# EAGLE schematic High-Level PCB v3.0 (EAGLE 8.7.0)
TITLE: High-Level PCB
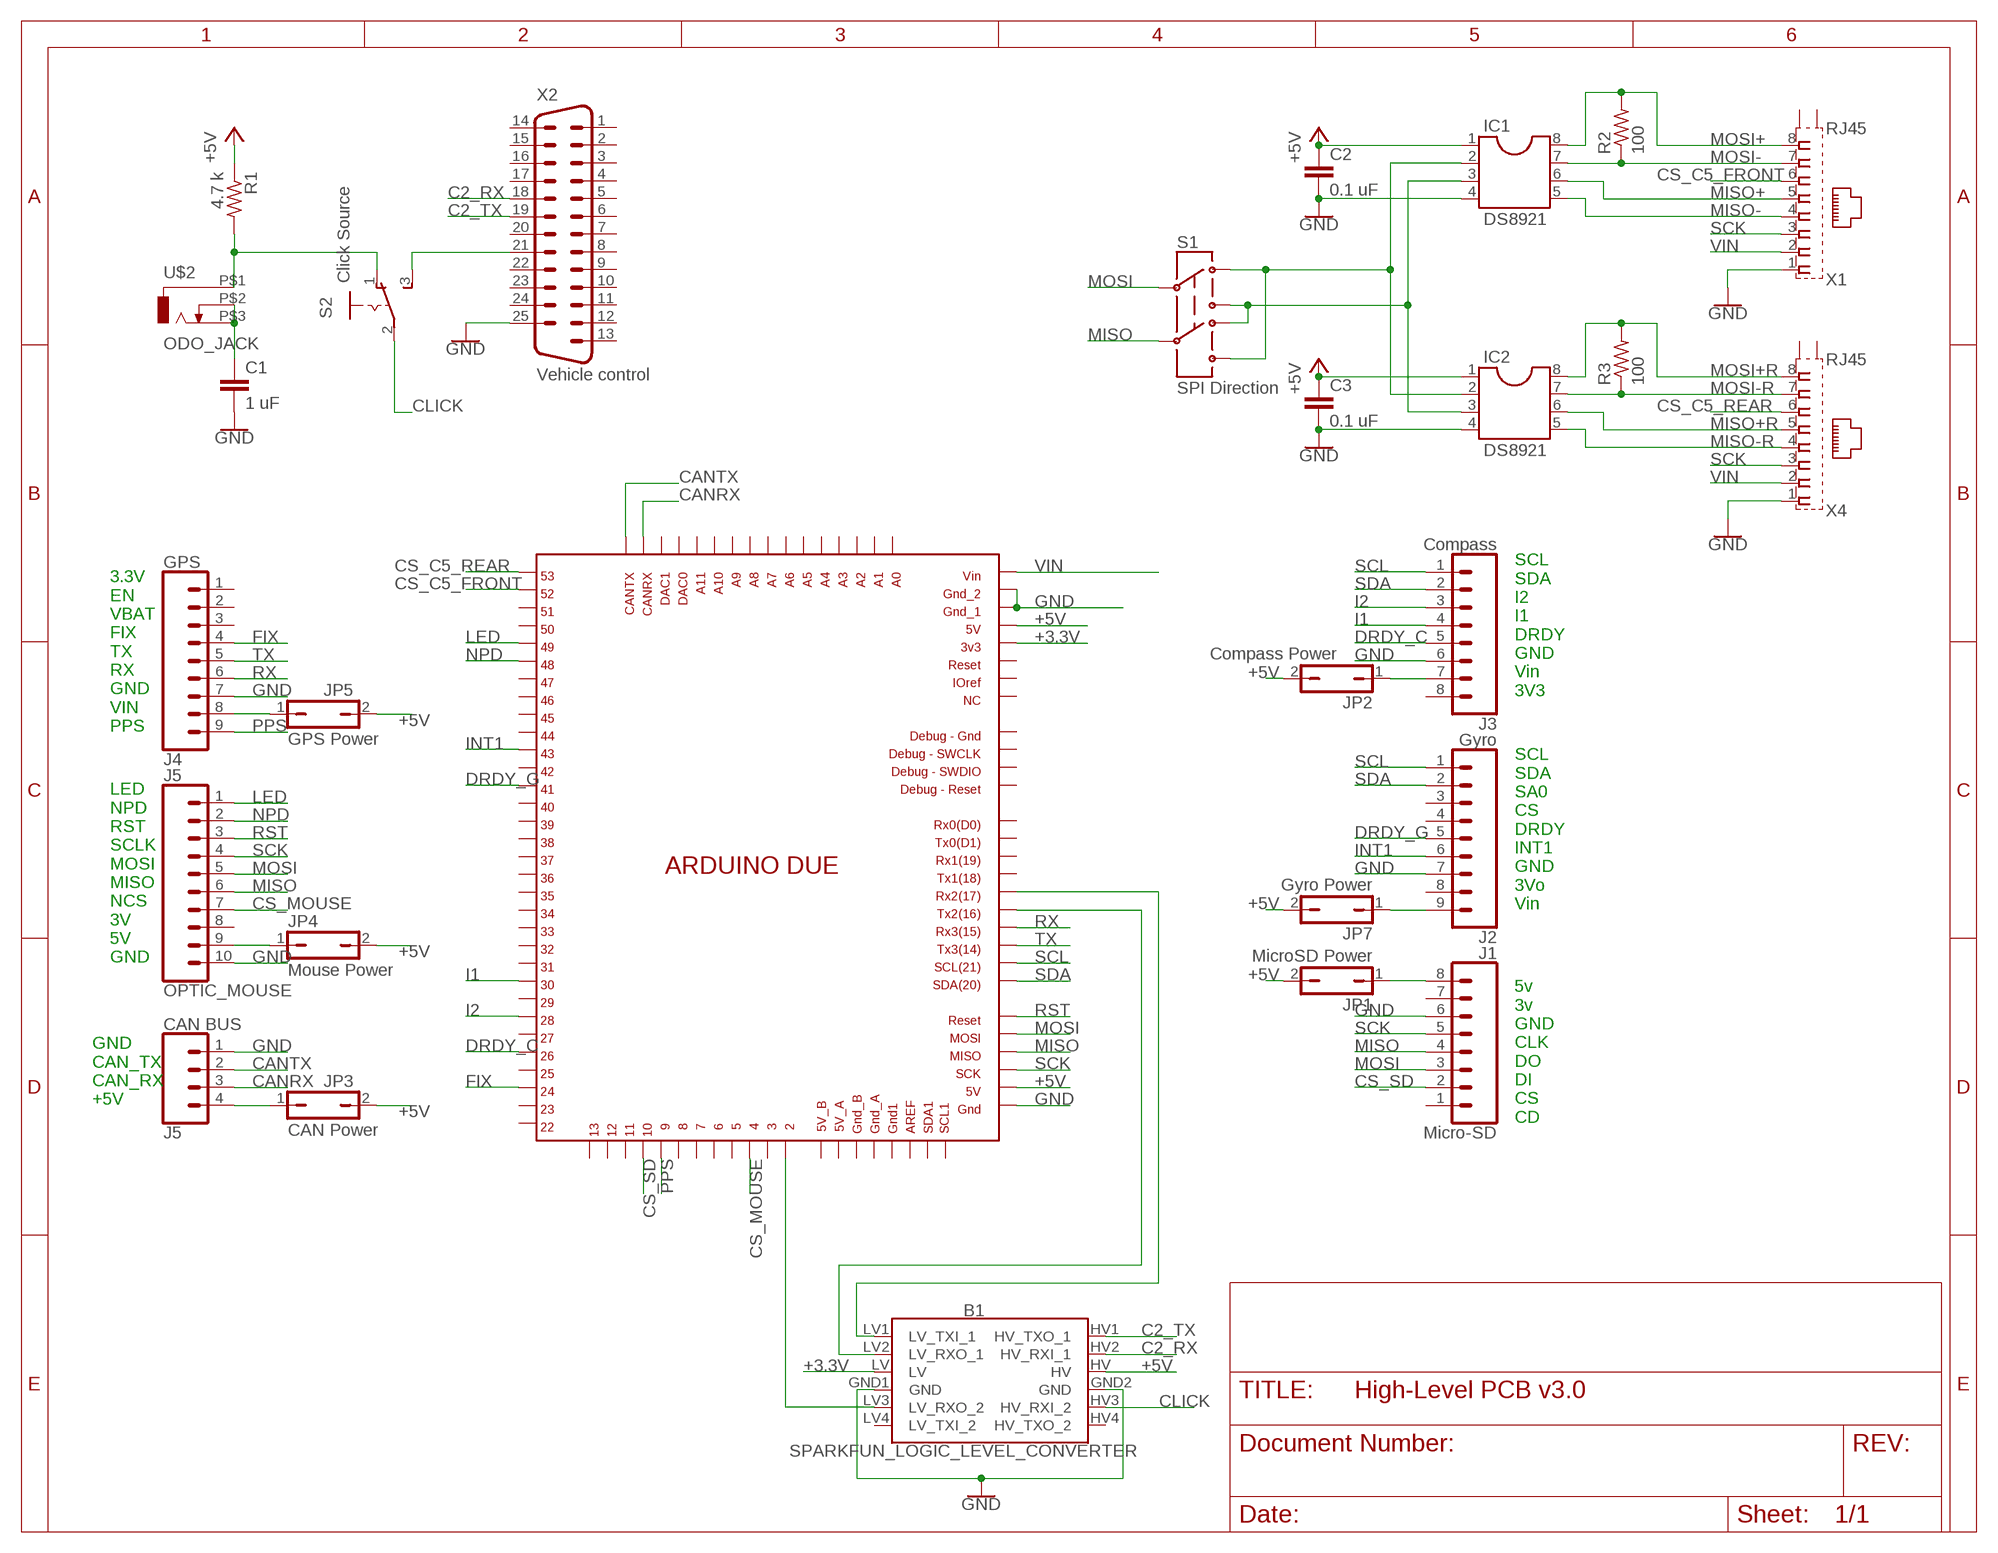
[diagram p0: schematic, sheet 1]

## Parts
B1  SPARKFUN_LOGIC_LEVEL_CONVERTER  [SPARKFUN_LOGIC_LEVEL_CONVERTER]
C1  1 uF  C2.5/5  [C2.5-5]
C2  0.1 uF  C2.5/5  [C2.5-5]
C3  0.1 uF  C2.5/5  [C2.5-5]
IC1  DS8921  DIL8  [DIL08]
IC2  DS8921  DIL8  [DIL08]
J1  Micro-SD  CONN_08"  [1X08]
J2  Gyro  CONN_09  [1X09]
J3  Compass  CONN_08"  [1X08]
J4  GPS  CONN_09  [1X09]
J5  CAN BUS  CONN_04  [1X04]
JP1  MicroSD Power  JP1Q  [JP1]
JP2  Compass Power  JP1Q  [JP1]
JP3  CAN Power  JP1Q  [JP1]
JP4  Mouse Power  JP1Q  [JP1]
JP5  GPS Power  JP1Q  [JP1]
JP7  Gyro Power  JP1Q  [JP1]
OPTIC_MOUSE  J5  CONN_10"  [1X10]
R1  4.7 k  R-US_0204/5  [0204/5]
R2  100  R-US_0204/5  [0204/5]
R3  100  R-US_0204/5  [0204/5]
S1  SPI Direction  DPDT_DEV6X5MM_PAC  [NEWSWITCH2_PAC]
S2  Click Source  255SB  [255SB]
U$1  DUE(NORMAL)  [DUE(NORMAL)]
U$2  ODO_JACK  [ODO_JACK]
X1  RJ45  GLX-S-88M  [GLX-S-88M]
X2  Vehicle control  M25H  [M25H]
X4  RJ45  GLX-S-88M  [GLX-S-88M]

## Nets
+3.3V: B1.LV U$1.3V3
+5V: B1.HV C2.1 C3.1 IC1.1 IC2.1 JP1.2 JP2.2 JP3.2 JP4.2 JP5.2 JP7.2 R1.1 U$1.5V U$1.GND_ICSP
C2_RX: B1.HV2(HV_RXI_1) X2.18
C2_TX: B1.HV1(HV_TXO_1) X2.19
CANRX: J5.3 U$1.CANRX
CANTX: J5.2 U$1.CANTX
CLICK: B1.HV3(HV_RXI_2) S2.2(P)
CS_C5_FRONT: U$1.52 X1.6
CS_C5_REAR: U$1.53 X4.6
CS_MOUSE: OPTIC_MOUSE.7 U$1.4
CS_SD: J1.2 U$1.10
DRDY_C: J3.5 U$1.26
DRDY_G: J2.5 U$1.41
FIX: J4.4 U$1.24
GND: B1.GND1(GND) B1.GND2(GND) C1.2 C2.2 C3.2 IC1.4 IC2.4 J1.6 J2.7 J3.6 J4.7 J5.1 OPTIC_MOUSE.10 U$1.5V_ICSP U$1.GND_1 U$1.GND_2 X1.1 X2.25 X4.1
I1: J3.4 U$1.30
I2: J3.3 U$1.28
INT1: J2.6 U$1.43
LED: OPTIC_MOUSE.1 U$1.49
MISO: J1.4 OPTIC_MOUSE.6 S1.PIN5 U$1.MISO_ICSP
MISO+: IC1.6 X1.5
MISO+R: IC2.6 X4.5
MISO-: IC1.5 X1.4
MISO-R: IC2.5 X4.4
MOSI: J1.3 OPTIC_MOUSE.5 S1.PIN2 U$1.MOSI_ICSP
MOSI+: IC1.8 R2.2 X1.8
MOSI+R: IC2.8 R3.2 X4.8
MOSI-: IC1.7 R2.1 X1.7
MOSI-R: IC2.7 R3.1 X4.7
N$1: C1.1 U$2.P$2 U$2.P$3
N$2: IC1.2 IC2.2 S1.PIN1 S1.PIN6
N$3: IC1.3 IC2.3 S1.PIN3 S1.PIN4
N$4: B1.LV1(LV_TXI_1) U$1.RX2
N$5: B1.LV2(LV_RXO_1) U$1.TX2
N$6: S2.3(S) X2.21
N$7: R1.2 S2.1(O) U$2.P$1
N$8: J3.7 JP2.1
N$9: J2.9 JP7.1
N$10: J1.8 JP1.1
N$11: J5.4 JP3.1
N$12: B1.LV3(LV_RXO_2) U$1.2
N$13: JP4.1 OPTIC_MOUSE.9
N$14: J4.8 JP5.1
NPD: OPTIC_MOUSE.2 U$1.48
PPS: J4.9 U$1.9
RST: OPTIC_MOUSE.3 U$1.RESET_ICSP
RX: J4.6 U$1.RX3
SCK: J1.5 OPTIC_MOUSE.4 U$1.SCK_ICSP X1.3 X4.3
SCL: J2.1 J3.1 U$1.SCL
SDA: J2.2 J3.2 U$1.SDA
TX: J4.5 U$1.TX3
VIN: U$1.VIN X1.2 X4.2
Unconnected: B1.HV4(HV_TXO_2) B1.LV4(LV_TXI_2) J1.1 J1.7 J2.3 J2.4 J2.8 J3.8 J4.1 J4.2 J4.3 OPTIC_MOUSE.8 U$1.3 U$1.5 U$1.5V_A U$1.5V_B U$1.6 U$1.7 U$1.8 U$1.11 U$1.12 U$1.13 U$1.22 U$1.23 U$1.25 U$1.27 U$1.29 U$1.31 U$1.32 U$1.33 U$1.34 U$1.35 U$1.36 U$1.37 U$1.38 U$1.39 U$1.40 U$1.42 U$1.44 U$1.45 U$1.46 U$1.47 U$1.50 U$1.51 U$1.A0 U$1.A1 U$1.A2 U$1.A3 U$1.A4 U$1.A5 U$1.A6 U$1.A7 U$1.A8 U$1.A9 U$1.A10 U$1.A11 U$1.AREF U$1.DAC0 U$1.DAC1 U$1.GND1 U$1.GND_A U$1.GND_B U$1.GND_DEBUG U$1.IOREF U$1.NC U$1.RESET U$1.RESET_DEBUG U$1.RX0 U$1.RX1 U$1.SCL1 U$1.SDA1 U$1.SWCLK_DEBUG U$1.SWDIO_DEBUG U$1.TX0 U$1.TX1 X1.S1 X1.S2 X2.1 X2.2 X2.3 X2.4 X2.5 X2.6 X2.7 X2.8 X2.9 X2.10 X2.11 X2.12 X2.13 X2.14 X2.15 X2.16 X2.17 X2.20 X2.22 X2.23 X2.24 X4.S1 X4.S2

## Notes on the sheet
- SCL
  SDA
  I2
  I1
  DRDY
  GND
  Vin
  3V3
- 3.3V
  EN
  VBAT
  FIX
  TX
  RX
  GND
  VIN
  PPS
- SCL
  SDA
  SA0
  CS
  DRDY
  INT1
  GND
  3Vo
  Vin
- LED
  NPD
  RST
  SCLK
  MOSI
  MISO
  NCS
  3V
  5V
  GND
- GND
  CAN_TX
  CAN_RX
  +5V
- 5v
  3v
  GND
  CLK
  DO
  DI
  CS
  CD

## Library data of the parts
B1 = SparkFun-Boards:SPARKFUN_LOGIC_LEVEL_CONVERTER: SparkFun Logic Level Converter -Bi-Directional This is the mechnical outline for the 3.3V - 5V bi directional logic level converter. *Note, the "LOCK" Package has the header pins staggered by an offset of 5 mils (off center line), so that when you slide a row of standard 0.1" headers into the PTH pads, it will hold position vertically. See the follwing turorial for more information on this type of special footprints: Sneaky Footprints <https://www.sparkfun.com/tutorials/114> SparkFun Products: SparkFun Logic Level Converter - Bi-Directional <https://www.sparkfun.com/products/12009>
C1-C3 = capacitor-wima:C: CAPACITOR naming: grid - package width
IC1 IC2 = ic-package:DIL8: Dual In Line / Socket
J1 J3 = SparkFun-Connectors:CONN_08: Multi connection point. Often used as Generic Header-pin footprint for 0.1 inch spaced/style header connections On any of the 0.1 inch spaced packages, you can populate with these: Break Away Headers - Straight <https://www.sparkfun.com/products/116> (PRT-00116) Break Away Male Headers - Right Angle <https://www.sparkfun.com/products/553> (PRT-00553) Female Headers <https://www.sparkfun.com/products/115> (PRT-00115) Break Away Headers - Machine Pin <https://www.sparkfun.com/products/117> (PRT-00117) Break Away Female Headers - Swiss Machine Pin <https://www.sparkfun.com/products/743> (PRT-00743) Arduino Stackable Header - 8 Pin <https://www.sparkfun.com/products/9279> (PRT-09279) For SCREWTERMINALS and SPRING TERMINALS visit here: Screw Terimnals on SparkFun.com <https://www.sparkfun.com/search/results?term=Screw+Terminals> (5mm/3.5mm/2.54mm spacing) This device is also useful as a general connection point to wire up your design to another part of your project. Our various solder wires solder well into these plated through hole pads. Hook-Up Wire - Assortment (Stranded, 22 AWG) <https://www.sparkfun.com/products/11375> (PRT-11375) Hook-Up Wire - Assortment (Solid Core, 22 AWG) <https://www.sparkfun.com/products/11367> (PRT-11367) View the entire wire category on our website here <https://www.sparkfun.com/categories/141> Special notes: Molex polarized connector foot print use with SKU : PRT-08231 with associated crimp pins and housings. 1MM SMD Version SKU: PRT-10208 NOTES ON THE VARIANTS LOCK and LOCK_LONGPADS... This footprint was designed to help hold the alignment of a through-hole component (i.e. 6-pin header) while soldering it into place. You may notice that each hole has been shifted either up or down by 0.005 of an inch from it's more standard position (which is a perfectly straight line). This slight alteration caused the pins (the squares in the middle) to touch the edges of the holes. Because they are alternating, it causes a "brace" to hold the component in place. 0.005 has proven to be the perfect amount of "off-center" position when using our standard breakaway headers. Although looks a little odd when you look at the bare footprint, once you have a header in there, the alteration is very hard to notice. Also,if you push a header all the way into place, it is covered up entirely on the bottom side.; PROD_ID: CONN-08438
J2 J4 = SparkFun-Connectors:CONN_09: Multi connection point. Often used as Generic Header-pin footprint for 0.1 inch spaced/style header connections On any of the 0.1 inch spaced packages, you can populate with these: Break Away Headers - Straight <https://www.sparkfun.com/products/116> (PRT-00116) Break Away Male Headers - Right Angle <https://www.sparkfun.com/products/553> (PRT-00553) Female Headers <https://www.sparkfun.com/products/115> (PRT-00115) Break Away Headers - Machine Pin <https://www.sparkfun.com/products/117> (PRT-00117) Break Away Female Headers - Swiss Machine Pin <https://www.sparkfun.com/products/743> (PRT-00743) For SCREWTERMINALS and SPRING TERMINALS visit here: Screw Terimnals on SparkFun.com <https://www.sparkfun.com/search/results?term=Screw+Terminals> (5mm/3.5mm/2.54mm spacing) This device is also useful as a general connection point to wire up your design to another part of your project. Our various solder wires solder well into these plated through hole pads. Hook-Up Wire - Assortment (Stranded, 22 AWG) <https://www.sparkfun.com/products/11375> (PRT-11375) Hook-Up Wire - Assortment (Solid Core, 22 AWG) <https://www.sparkfun.com/products/11367> (PRT-11367) View the entire wire category on our website here <https://www.sparkfun.com/categories/141> Special notes: Molex polarized connector foot print use with SKU : PRT-08231 with associated crimp pins and housings. 1MM SMD Version SKU: PRT-10208 NOTES ON THE VARIANTS LOCK and LOCK_LONGPADS... This footprint was designed to help hold the alignment of a through-hole component (i.e. 6-pin header) while soldering it into place. You may notice that each hole has been shifted either up or down by 0.005 of an inch from it's more standard position (which is a perfectly straight line). This slight alteration caused the pins (the squares in the middle) to touch the edges of the holes. Because they are alternating, it causes a "brace" to hold the component in place. 0.005 has proven to be the perfect amount of "off-center" position when using our standard breakaway headers. Although looks a little odd when you look at the bare footprint, once you have a header in there, the alteration is very hard to notice. Also,if you push a header all the way into place, it is covered up entirely on the bottom side.
J5 = SparkFun-Connectors:CONN_04: Multi connection point. Often used as Generic Header-pin footprint for 0.1 inch spaced/style header connections On any of the 0.1 inch spaced packages, you can populate with these: Break Away Headers - Straight <https://www.sparkfun.com/products/116> (PRT-00116) Break Away Male Headers - Right Angle <https://www.sparkfun.com/products/553> (PRT-00553) Female Headers <https://www.sparkfun.com/products/115> (PRT-00115) Break Away Headers - Machine Pin <https://www.sparkfun.com/products/117> (PRT-00117) Break Away Female Headers - Swiss Machine Pin <https://www.sparkfun.com/products/743> (PRT-00743) For SCREWTERMINALS and SPRING TERMINALS visit here: Screw Terimnals on SparkFun.com <https://www.sparkfun.com/search/results?term=Screw+Terminals> (5mm/3.5mm/2.54mm spacing) This device is also useful as a general connection point to wire up your design to another part of your project. Our various solder wires solder well into these plated through hole pads. Hook-Up Wire - Assortment (Stranded, 22 AWG) <https://www.sparkfun.com/products/11375> (PRT-11375) Hook-Up Wire - Assortment (Solid Core, 22 AWG) <https://www.sparkfun.com/products/11367> (PRT-11367) View the entire wire category on our website here <https://www.sparkfun.com/categories/141> Special notes: Molex polarized connector foot print use with SKU : PRT-08231 with associated crimp pins and housings. 1MM SMD Version SKU: PRT-10208; PROD_ID: CONN-09696
JP1-JP5 JP7 = jumper:JP1Q: JUMPER
OPTIC_MOUSE = SparkFun-Connectors:CONN_10: Multi connection point. Often used as Generic Header-pin footprint for 0.1 inch spaced/style header connections On any of the 0.1 inch spaced packages, you can populate with these: Break Away Headers - Straight <https://www.sparkfun.com/products/116> (PRT-00116) Break Away Male Headers - Right Angle <https://www.sparkfun.com/products/553> (PRT-00553) Female Headers <https://www.sparkfun.com/products/115> (PRT-00115) Break Away Headers - Machine Pin <https://www.sparkfun.com/products/117> (PRT-00117) Break Away Female Headers - Swiss Machine Pin <https://www.sparkfun.com/products/743> (PRT-00743) Arduino Stackable Header - 10 Pin <https://www.sparkfun.com/products/11376> (PRT-11376) For SCREWTERMINALS and SPRING TERMINALS visit here: Screw Terimnals on SparkFun.com <https://www.sparkfun.com/search/results?term=Screw+Terminals> (5mm/3.5mm/2.54mm spacing) This device is also useful as a general connection point to wire up your design to another part of your project. Our various solder wires solder well into these plated through hole pads. Hook-Up Wire - Assortment (Stranded, 22 AWG) <https://www.sparkfun.com/products/11375> (PRT-11375) Hook-Up Wire - Assortment (Solid Core, 22 AWG) <https://www.sparkfun.com/products/11367> (PRT-11367) View the entire wire category on our website here <https://www.sparkfun.com/categories/141> Special notes: Molex polarized connector foot print use with SKU : PRT-08231 with associated crimp pins and housings. 1MM SMD Version SKU: PRT-10208 NOTES ON THE VARIANTS LOCK and LOCK_LONGPADS... This footprint was designed to help hold the alignment of a through-hole component (i.e. 6-pin header) while soldering it into place. You may notice that each hole has been shifted either up or down by 0.005 of an inch from it's more standard position (which is a perfectly straight line). This slight alteration caused the pins (the squares in the middle) to touch the edges of the holes. Because they are alternating, it causes a "brace" to hold the component in place. 0.005 has proven to be the perfect amount of "off-center" position when using our standard breakaway headers. Although looks a little odd when you look at the bare footprint, once you have a header in there, the alteration is very hard to notice. Also,if you push a header all the way into place, it is covered up entirely on the bottom side.; PROD_ID: CONN-11563
R1 = resistor:R-US_: RESISTOR, American symbol
R2 R3 = rcl:R-US_: RESISTOR, American symbol; SPICEPREFIX: R
S1 = elcanoParts:DPDT_DEV
S2 = switch:255SB: SLIDING SWITCH Distributor Buerklin, 11G810
U$1 = DUElib130425:DUE(NORMAL)
U$2 = elcanoParts:ODO_JACK
X1 X4 = con-kycon:GLX-S-88M: Mod. Jack, Right Angle, 8 posiotion, 8 contatcs RJ45 Source: GLX-S-88M.pdf; OC_FARNELL: unknown; OC_NEWARK: unknown
X2 = con-subd:M25: SUB-D; OC_FARNELL: unknown; OC_NEWARK: unknown